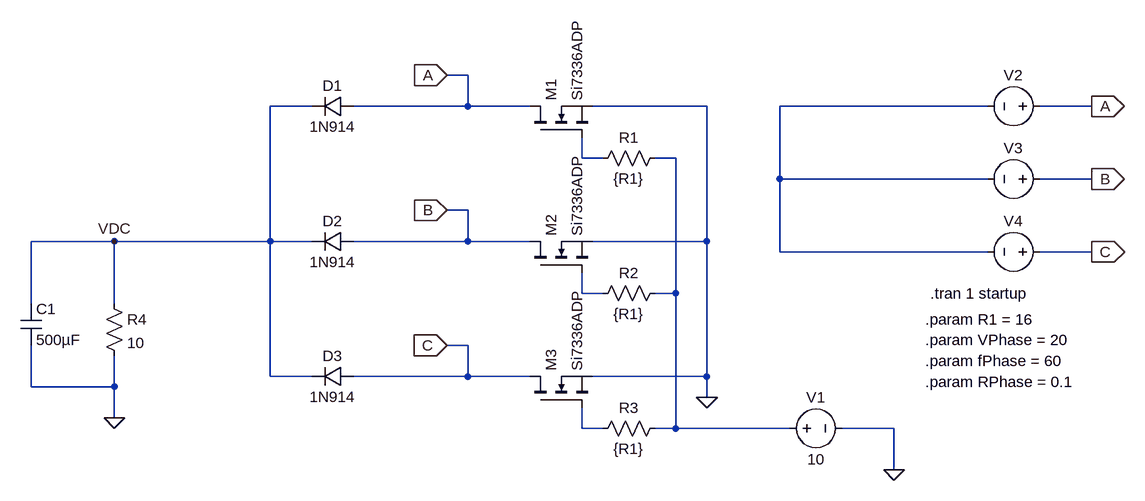
[diagram p0: schematic shrektifier.asc]
shrektifier.asc, the LTspice schematic file:
Version 4
SHEET 1 1372 680
WIRE 240 -48 208 -48
WIRE 0 0 -64 0
WIRE 240 0 240 -48
WIRE 240 0 64 0
WIRE 336 0 240 0
WIRE 608 0 432 0
WIRE 1040 0 720 0
WIRE 1200 0 1120 0
WIRE 416 80 416 48
WIRE 448 80 416 80
WIRE 560 80 528 80
WIRE 720 112 720 0
WIRE 1040 112 720 112
WIRE 1200 112 1120 112
WIRE 240 160 208 160
WIRE -304 208 -432 208
WIRE -64 208 -64 0
WIRE -64 208 -304 208
WIRE 0 208 -64 208
WIRE 240 208 240 160
WIRE 240 208 64 208
WIRE 336 208 240 208
WIRE 608 208 608 0
WIRE 608 208 432 208
WIRE 720 224 720 112
WIRE 1040 224 720 224
WIRE 1200 224 1120 224
WIRE 416 288 416 256
WIRE 448 288 416 288
WIRE 560 288 560 80
WIRE 560 288 528 288
WIRE -432 304 -432 208
WIRE -304 304 -304 208
WIRE 240 368 208 368
WIRE -64 416 -64 208
WIRE 0 416 -64 416
WIRE 240 416 240 368
WIRE 240 416 64 416
WIRE 336 416 240 416
WIRE 608 416 608 208
WIRE 608 416 432 416
WIRE -432 432 -432 368
WIRE -304 432 -304 384
WIRE -304 432 -432 432
WIRE 608 448 608 416
WIRE -304 480 -304 432
WIRE 416 496 416 464
WIRE 448 496 416 496
WIRE 560 496 560 288
WIRE 560 496 528 496
WIRE 736 496 560 496
WIRE 896 496 816 496
WIRE 896 560 896 496
FLAG 896 560 0
FLAG 608 448 0
FLAG -304 480 0
FLAG 208 -48 A
IOPIN 208 -48 In
FLAG 208 160 B
IOPIN 208 160 In
FLAG 208 368 C
IOPIN 208 368 In
FLAG 1200 0 A
IOPIN 1200 0 Out
FLAG 1200 112 B
IOPIN 1200 112 Out
FLAG 1200 224 C
IOPIN 1200 224 Out
FLAG -304 208 VDC
SYMBOL diode 64 -16 R90
WINDOW 0 0 32 VBottom 2
WINDOW 3 32 32 VTop 2
SYMATTR InstName D1
SYMATTR Value 1N914
SYMBOL diode 64 192 R90
WINDOW 0 0 32 VBottom 2
WINDOW 3 32 32 VTop 2
SYMATTR InstName D2
SYMATTR Value 1N914
SYMBOL diode 64 400 R90
WINDOW 0 0 32 VBottom 2
WINDOW 3 32 32 VTop 2
SYMATTR InstName D3
SYMATTR Value 1N914
SYMBOL nmos 336 48 R270
SYMATTR InstName M1
SYMATTR Value Si7336ADP
SYMBOL nmos 336 256 R270
SYMATTR InstName M2
SYMATTR Value Si7336ADP
SYMBOL nmos 336 464 R270
SYMATTR InstName M3
SYMATTR Value Si7336ADP
SYMBOL res 544 64 R90
WINDOW 0 0 56 VBottom 2
WINDOW 3 32 56 VTop 2
SYMATTR InstName R1
SYMATTR Value {R1}
SYMBOL res 544 272 R90
WINDOW 0 0 56 VBottom 2
WINDOW 3 32 56 VTop 2
SYMATTR InstName R2
SYMATTR Value {R1}
SYMBOL res 544 480 R90
WINDOW 0 0 56 VBottom 2
WINDOW 3 32 56 VTop 2
SYMATTR InstName R3
SYMATTR Value {R1}
SYMBOL voltage 720 496 R270
WINDOW 0 32 56 VTop 2
WINDOW 3 -32 56 VBottom 2
WINDOW 123 0 0 Left 0
WINDOW 39 0 0 Left 0
SYMATTR InstName V1
SYMATTR Value 10
SYMBOL cap -448 304 R0
SYMATTR InstName C1
SYMATTR Value 500µF
SYMBOL res -320 288 R0
SYMATTR InstName R4
SYMATTR Value 10
SYMBOL voltage 1136 0 R90
WINDOW 0 -32 56 VBottom 2
WINDOW 3 32 56 Invisible 2
WINDOW 123 0 0 Left 0
SYMATTR InstName V2
SYMATTR Value SINE(0 {VPhase} {fPhase} 0 0 0)
SYMATTR SpiceLine Rser={RPhase}
SYMBOL voltage 1136 112 R90
WINDOW 0 -32 56 VBottom 2
WINDOW 3 32 56 Invisible 2
WINDOW 123 0 0 Left 0
SYMATTR InstName V3
SYMATTR Value SINE(0 {VPhase} {fPhase} 0 0 120)
SYMATTR SpiceLine Rser={RPhase}
SYMBOL voltage 1136 224 R90
WINDOW 0 -32 56 VBottom 2
WINDOW 3 32 56 Invisible 2
WINDOW 123 0 0 Left 0
SYMATTR InstName V4
SYMATTR Value SINE(0 {VPhase} {fPhase} 0 0 -120)
SYMATTR SpiceLine Rser={RPhase}
TEXT 944 328 Left 2 !.param R1 = 16
TEXT 944 360 Left 2 !.param VPhase = 20
TEXT 944 392 Left 2 !.param fPhase = 60
TEXT 952 288 Left 2 !.tran 1 startup
TEXT 944 424 Left 2 !.param RPhase = 0.1

The netlist it stands for:
* shrektifier.asc
D1 A VDC 1N914
D2 B VDC 1N914
D3 C VDC 1N914
M1 A N002 0 0 Si7336ADP
M2 B N004 0 0 Si7336ADP
M3 C N005 0 0 Si7336ADP
R1 N003 N002 {R1}
R2 N003 N004 {R1}
R3 N003 N005 {R1}
V1 N003 0 10
C1 VDC 0 500µF
R4 VDC 0 10
V2 A N001 SINE(0 {VPhase} {fPhase} 0 0 0) Rser={RPhase}
V3 B N001 SINE(0 {VPhase} {fPhase} 0 0 120) Rser={RPhase}
V4 C N001 SINE(0 {VPhase} {fPhase} 0 0 -120) Rser={RPhase}
.model D D
.lib standard.dio
.model NMOS NMOS
.model PMOS PMOS
.lib standard.mos
.param R1 = 16
.param VPhase = 20
.param fPhase = 60
.tran 1 startup
.param RPhase = 0.1
.backanno
.end

* Results of the author's LTspice run, read from the files saved beside the schematic
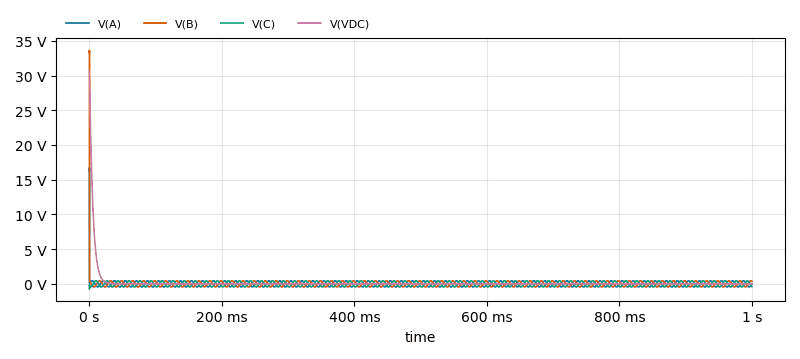
[diagram p1: Transient Analysis of shrektifier.asc, plotted from the saved traces]
* Transient Analysis, 1 run:
*   V(A): min -440.9 mV, max 16.72 V, average 750.4 µV, rms 316.2 mV, last 14.85 µV
*   V(B): min -441.5 mV, max 33.62 V, average 856.4 µV, rms 325.6 mV, last 384.7 mV
*   V(C): min -711.2 mV, max 444.4 mV, average 763.2 µV, rms 313.3 mV, last -382.7 mV
*   V(VDC): min 145.6 µV, max 30.63 V, average 153.8 mV, rms 1.537 V, last 213.8 µV